# EAGLE design connection (EAGLE 6.2)
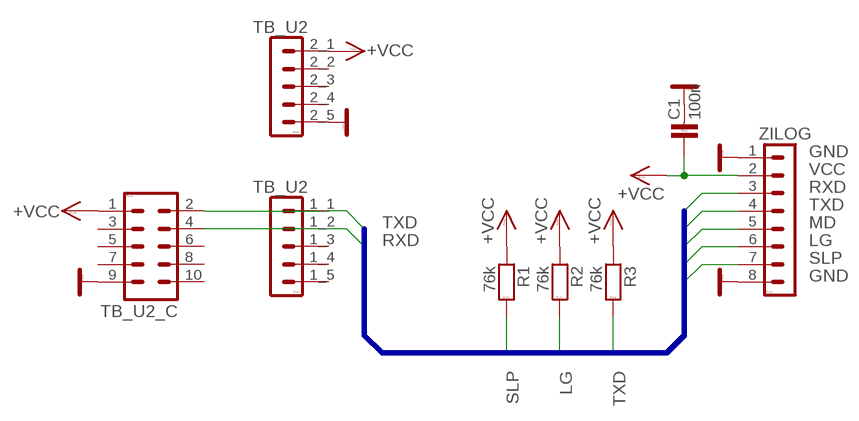
[diagram p0: schematic, sheet 1]

## Parts
C1  100n  C-KERAMIK_SMD_1206  [1206]
R1  76k  R_SMD_1206  [1206]
R2  76k  R_SMD_1206  [1206]
R3  76k  R_SMD_1206  [1206]
TB_U2  S2G5_JUMP  [S2G5_JUM]
TB_U2_C  MLW10  [MLW10G]
ZILOG  S1G8_JUMP  [S1G8_JUM]

## Nets
GND: C1.2 TB_U2.2_5 TB_U2_C.9 ZILOG.1 ZILOG.8
LG: R2.2 ZILOG.6
MD: ZILOG.5
RXD: TB_U2.1_2 TB_U2_C.4 ZILOG.3
SLP: R1.2 ZILOG.7
TXD: R3.2 TB_U2.1_1 TB_U2_C.2 ZILOG.4
VCC: C1.1 R1.1 R2.1 R3.1 TB_U2.2_1 TB_U2_C.1 ZILOG.2 ; supply symbol labelled +VCC
Unconnected: TB_U2.1_3 TB_U2.1_4 TB_U2.1_5 TB_U2.2_2 TB_U2.2_3 TB_U2.2_4 TB_U2_C.3 TB_U2_C.5 TB_U2_C.6 TB_U2_C.7 TB_U2_C.8 TB_U2_C.10

## Buses
RXD,TXD,LG,SLP,MD

## Library data of the parts
C1 = #PaJa_30:C-KERAMIK: Kondenzator - keramicky
R1-R3 = #PaJa_30:R: Rezistor
TB_U2 = #PaJa_konektory:S2G5_JUMP: Radove konektory - koliky - dvojite - 2x5
TB_U2_C = #PaJa_konektory:MLW10: Konektory MLW - vidlice - 10x
ZILOG = #PaJa_konektory:S1G8_JUMP: Radove konektory - koliky - 8x

## Board
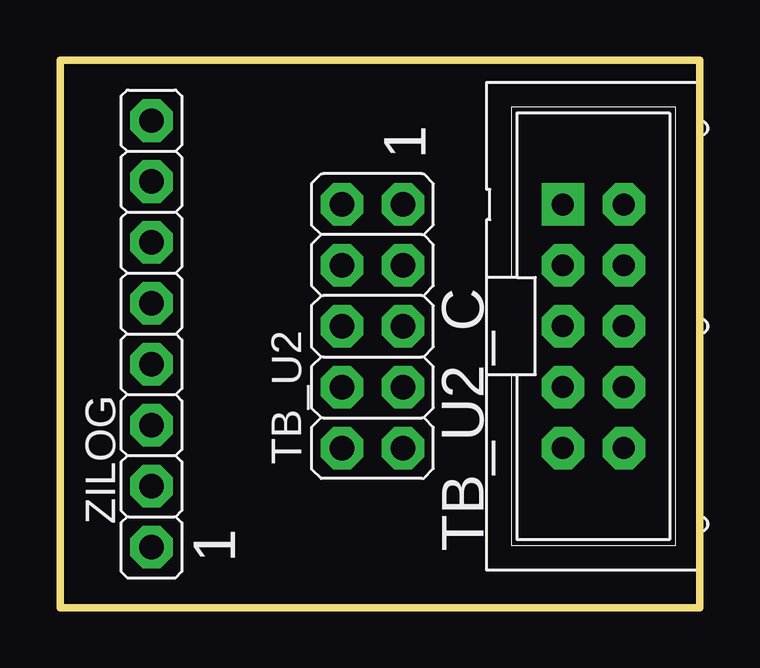
[diagram p1: board, top side]
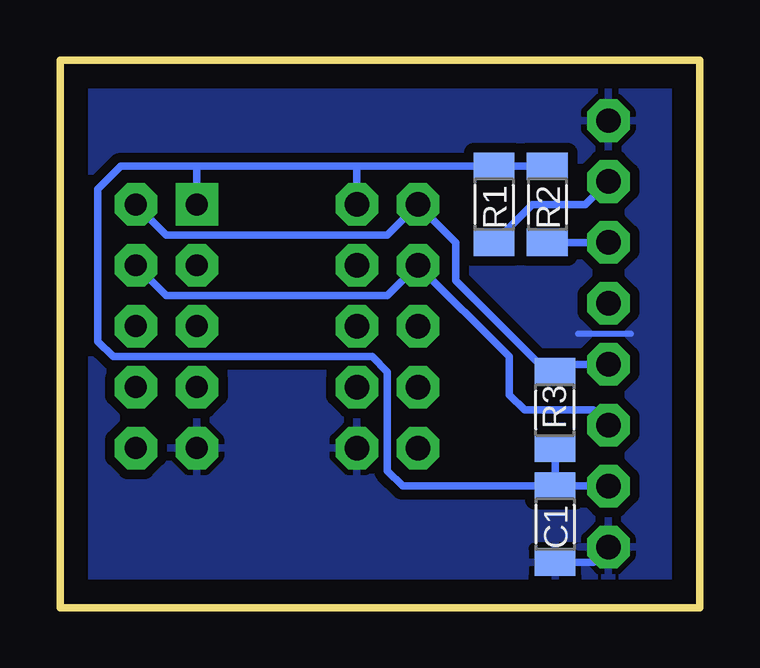
[diagram p2: board, bottom side, seen from below]

Size 26.66 x 22.85 mm. Coordinates in mm from the lower left corner, seen from the top.
Outline: 0,0 26.66,0 26.66,22.85 0,22.85 0,0
Copper layers (1*16): Top 0.035mm / dielectric 1.5mm / Bottom 0.035mm
Design rules: minimum track width 10mil, minimum drill 24mil, track to track 8mil, track to pad 8mil, pad to pad 8mil, via to via 8mil, smd to smd 8mil, copper to edge 40mil, drill to drill 8mil, minimum pad ring 10mil, minimum via ring 8mil, stop-mask expansion 4mil, vias tented up to drill 0mil, thermal gap 10mil

### Footprints (pad centres in the part's own frame; a part is rotated, then mirrored left to right if it is on the bottom)
1206 = smd 1.143 x 1.702: 1 -1.587,0; 2 1.587,0
S2G5_JUM = drill 1.016 pad 1.778 octagon: 1_1 -5.08,-1.27; 1_2 -2.54,-1.27; 1_3 0,-1.27; 1_4 2.54,-1.27; 1_5 5.08,-1.27; 2_1 -5.08,1.27; 2_2 -2.54,1.27; 2_3 0,1.27; 2_4 2.54,1.27; 2_5 5.08,1.27
MLW10G = drill 0.914 pad 1.778 square: 1 -5.08,-1.27 | drill 0.914 pad 1.778 octagon: 2 -5.08,1.27; 3 -2.54,-1.27; 4 -2.54,1.27; 5 0,-1.27; 6 0,1.27; 7 2.54,-1.27; 8 2.54,1.27; 9 5.08,-1.27; 10 5.08,1.27
S1G8_JUM = drill 1.016 pad 1.778 octagon: 1 -8.89,0; 2 -6.35,0; 3 -3.81,0; 4 -1.27,0; 5 1.27,0; 6 3.81,0; 7 6.35,0; 8 8.89,0

### Placement (x,y rotation side)
C1  6.03,3.49 270 bottom
R1  8.57,16.83 270 bottom
R2  6.35,16.83 270 bottom
R3  6.03,8.26 90 bottom
TB_U2  13.02,11.75 270 top
TB_U2_C  22.23,11.75 270 top
ZILOG  3.81,11.43 90 top

### Tracks (layer width: path | path; a pad name or v marks a point on that pad's centre or on a via)
GND
  Bottom 0.254: 2.86,11.43 5.08,11.43
  Bottom 0.305: ZILOG.1 4.45,1.91 C1.2
  pour Bottom (isolate 0.406): 0,0 26.67,0 26.67,22.86 0,22.86
LG
  Bottom 0.305: ZILOG.6 R2.2
N$1
  pour Bottom (no thermals): 13.02,4.13 13.97,5.08 25.4,5.4 25.4,0.64 10.48,0.64 10.48,4.13
N$2
  pour Bottom (no thermals): 18.73,19.05 18.73,21.59 25.08,21.59 25.08,19.05
RXD
  Bottom 0.305: ZILOG.3 4.45,8.26 7.3,8.26 7.94,8.89 7.94,10.48 TB_U2.1_2 13.02,13.02 22.23,13.02 TB_U2_C.4
SLP
  Bottom 0.305: ZILOG.7 4.76,16.83 6.99,16.83 R1.2
TXD
  Bottom 0.305: ZILOG.4 6.67,10.16 | 6.67,10.16 10.16,13.65 10.16,15.24 TB_U2.1_1 13.02,15.56 22.23,15.56 TB_U2_C.2 | 6.67,10.16 6.35,9.84 R3.2
VCC
  Bottom 0.305: C1.1 ZILOG.2 | R2.1 R1.1 14.29,18.41 | C1.1 12.38,5.08 13.02,5.71 13.02,9.84 13.65,10.48 24.45,10.48 25.08,11.11 25.08,17.46 24.13,18.41 20.95,18.41 | C1.1 R3.1 | 14.29,18.41 TB_U2.2_1 | TB_U2_C.1 20.95,18.41 | 20.95,18.41 14.29,18.41

### Text on the board
tPlace: 1 | 1
bRestrict: 2012 | TB Redukce | Marcel Gazdík